# Altium schematic sheet Mini_Converter_2024-05-02.schdoc
size 151 x 91 mm
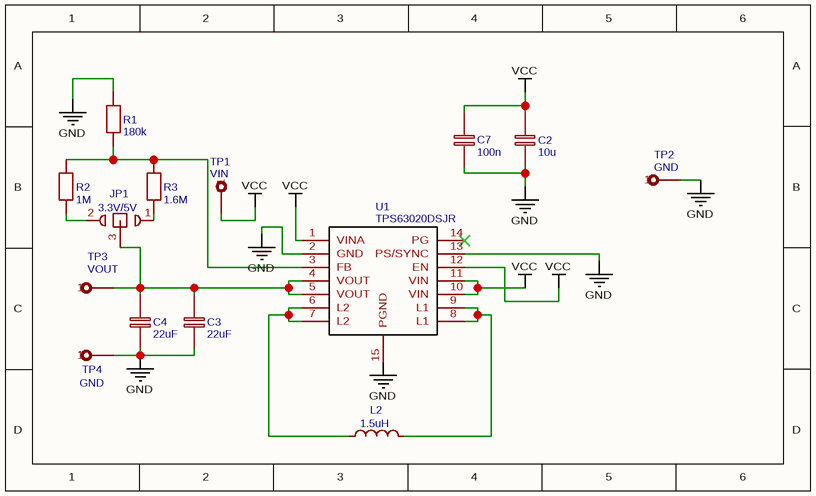
[diagram p0: Mini_Converter_2024-05-02.schdoc]

## Parts
C2  10u  [C0805]
C3  22uF  [C0805]
C4  22uF  [C0805]
C7  100n  [C0805]
JP1  3.3V/5V  [SOLDER BRIDGE 3P UNBRIDGED]
L2  1.5uH  [IND-SMD_L3.0-W3.0-SPM3020-2R2M]
R1  180k  [R0805]
R2  1M  [R0805]
R3  1.6M  [R0805]
TP1  VIN  [PKG-TEST-POINT-PTH-1X1]
TP2  GND  [PKG-TEST-POINT-PTH-1X1]
TP3  VOUT  [PKG-TEST-POINT-PTH-1X1]
TP4  GND  [PKG-TEST-POINT-PTH-1X1]
U1  TPS63020DSJR  [VSON-14_L4.0-W3.0-P0.50-BL-EP_TI_DSJ]

## Nets
GND: C2.1 C3.1 C4.1 C7.1 R1.2 TP2.1 TP4.1 U1.2(GND) U1.13(PS/SYNC) U1.15(PGND)
VCC: C2.2 C7.2 TP1.1 U1.1(VINA) U1.10(VIN) U1.11(VIN) U1.12(EN)
NetC3_2: C3.2 C4.2 JP1.3 TP3.1 U1.4(VOUT) U1.5(VOUT)
NetJP1_1: JP1.1 R3.1
NetJP1_2: JP1.2 R2.1
NetL2_1: L2.1 U1.6(L2) U1.7(L2)
NetL2_2: L2.2 U1.8(L1) U1.9(L1)
NetR1_1: R1.1 R2.2 R3.2 U1.3(FB)

Not connected (* = marked no-connect by the designer): U1 14(PG)*

## Library data of the parts
C2 = 10u: nameAlias: Value(F); Contributor: LCEDA_Lib; spicePre: C; spiceSymbolName: C_0805_EU
C3 C4 = 22uF: nameAlias: Value(F); Contributor: LCEDA_Lib; spicePre: C; spiceSymbolName: C_0805_EU
C7 = 100n: nameAlias: Value(F); Contributor: LCEDA_Lib; spicePre: C; spiceSymbolName: C_0805_EU
JP1 = 3.3V/5V: Contributor: leif; spicePre: J; spiceSymbolName: SOLDER BRIDGE
L2 = 1.5uH: Manufacturer Part: 78438336100; Contributor: LCSC; Supplier: LCSC; Supplier Part: C2915156; JLCPCB Part Class: Extended Part; link: https://lcsc.com/eda_search?q=C2915156&%26type=1&ref=editor; spicePre: L; spiceSymbolName: 78438336100
R1 = 180k: nameAlias: Value(Ω); Contributor: LCEDA_Lib; spicePre: R; spiceSymbolName: R_0805_EU
R2 = 1M: nameAlias: Value(Ω); Contributor: LCEDA_Lib; spicePre: R; spiceSymbolName: R_0805_EU
R3 = 1.6M: nameAlias: Value(Ω); Contributor: LCEDA_Lib; spicePre: R; spiceSymbolName: R_0805_EU
U1 = TPS63020DSJR: Manufacturer: TI(德州仪器); Supplier: LCSC; Manufacturer Part: TPS63020DSJR; Supplier Part: C15483; JLCPCB Part Class: Extended Part; link: https://lcsc.com/eda_search?q=C15483&%26type=1&ref=editor; spicePre: U; spiceSymbolName: TPS63020DSJR
TP1 = VIN: spicePre: T; spiceSymbolName: TEST-POINT-PTH-1X1
TP2 TP4 = GND: spicePre: T; spiceSymbolName: TEST-POINT-PTH-1X1
TP3 = VOUT: spicePre: T; spiceSymbolName: TEST-POINT-PTH-1X1